# Altium project CoreV0.2.PrjPCB
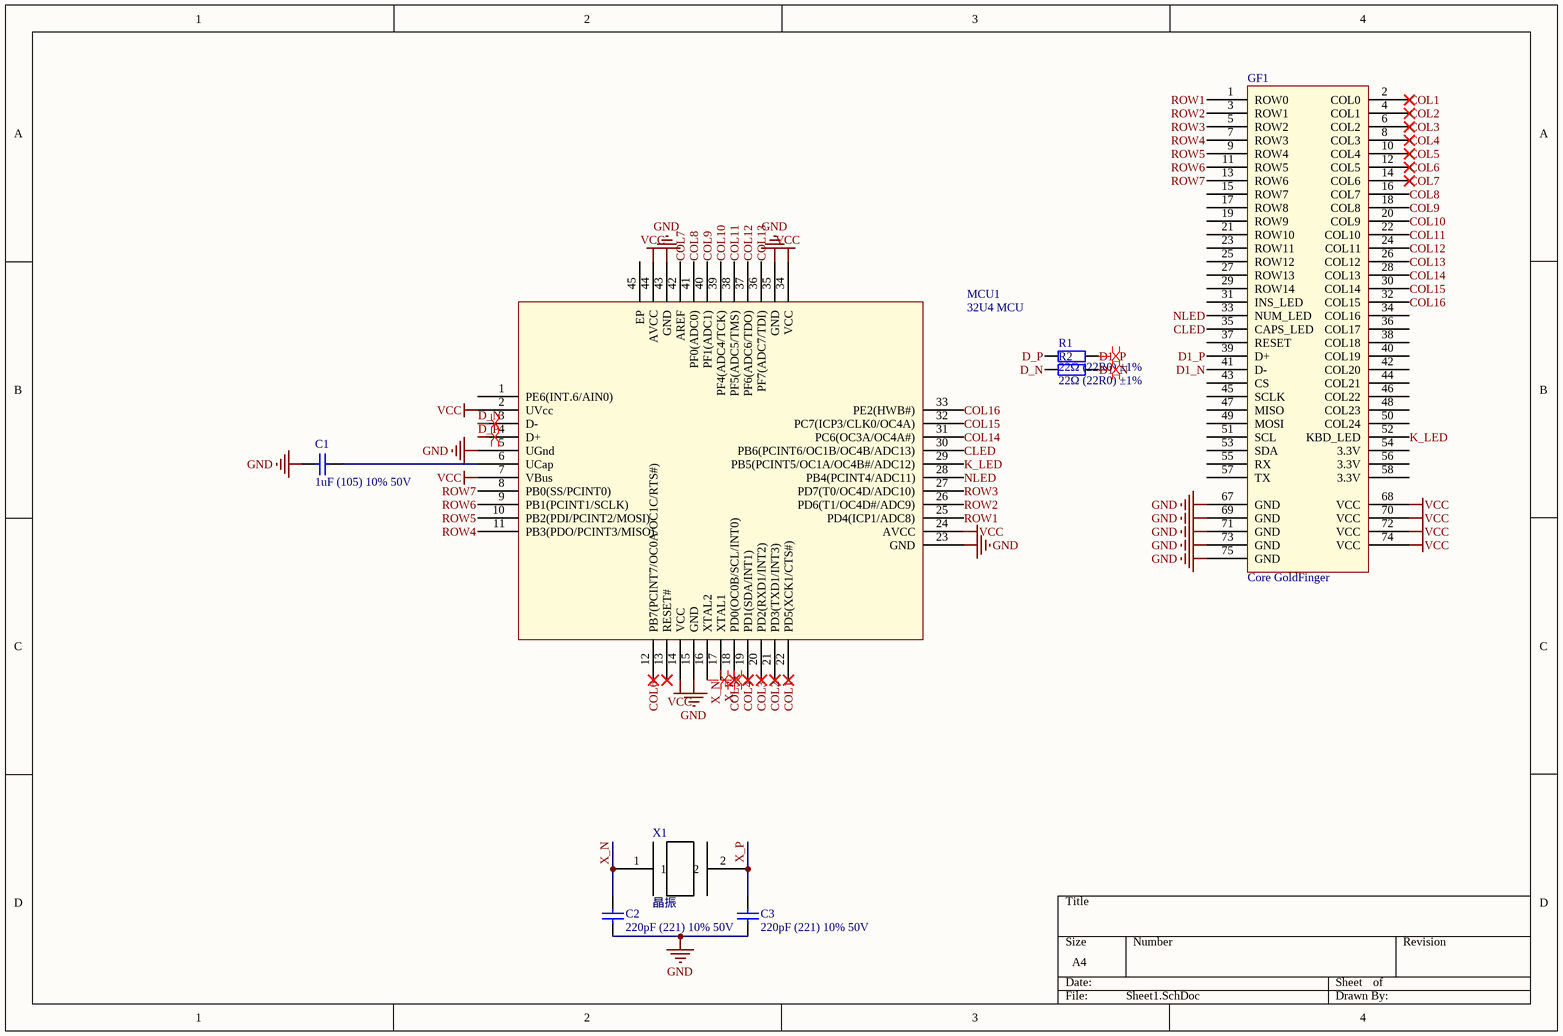
[diagram p0: Sheet1.SchDoc]
1 sheet, 8 parts. Net scope: global (net labels, ports and power ports of the same name join across sheets).
Board file: PCB1.PcbDoc

## Sheet Sheet1.SchDoc
size A4

### Parts
C1  1uF (105) 10% 50V  [1206_C]
C2  220pF (221) 10% 50V  [1206_C]
C3  220pF (221) 10% 50V  [1206_C]
GF1  Core GoldFinger  [Core GoldFinger]
MCU1  32U4 MCU  [32U4]
R1  22Ω (22R0) ±1%  [1206_R]
R2  22Ω (22R0) ±1%  [1206_R]
X1  晶振  [OSC-SMD_2P-L5.0-W3.2]

### Nets
GND: C1.1 C2.1 C3.1 GF1.67(GND) GF1.69(GND) GF1.71(GND) GF1.73(GND) GF1.75(GND) MCU1.5(UGnd) MCU1.15(GND) MCU1.23(GND) MCU1.35(GND) MCU1.43(GND)
VCC: GF1.68(VCC) GF1.70(VCC) GF1.72(VCC) GF1.74(VCC) MCU1.2(UVcc) MCU1.7(VBus) MCU1.14(VCC) MCU1.24(AVCC) MCU1.34(VCC) MCU1.44(AVCC)
CLED: GF1.35(CAPS_LED) MCU1.30(PB6(PCINT6/OC1B/OC4B/ADC13))
COL1: GF1.2(COL0) MCU1.22(PD5(XCK1/CTS#))
COL2: GF1.4(COL1) MCU1.21(PD3(TXD1/INT3))
COL3: GF1.6(COL2) MCU1.20(PD2(RXD1/INT2))
COL4: GF1.8(COL3) MCU1.19(PD1(SDA/INT1))
COL5: GF1.10(COL4) MCU1.18(PD0(OC0B/SCL/INT0))
COL6: GF1.12(COL5) MCU1.12(PB7(PCINT7/OC0A/OC1C/RTS#))
COL7: GF1.14(COL6) MCU1.42(AREF)
COL8: GF1.16(COL7) MCU1.41(PF0(ADC0))
COL9: GF1.18(COL8) MCU1.40(PF1(ADC1))
COL10: GF1.20(COL9) MCU1.39(PF4(ADC4/TCK))
COL11: GF1.22(COL10) MCU1.38(PF5(ADC5/TMS))
COL12: GF1.24(COL11) MCU1.37(PF6(ADC6/TDO))
COL13: GF1.26(COL12) MCU1.36(PF7(ADC7/TDI))
COL14: GF1.28(COL13) MCU1.31(PC6(OC3A/OC4A#))
COL15: GF1.30(COL14) MCU1.32(PC7(ICP3/CLK0/OC4A))
COL16: GF1.32(COL15) MCU1.33(PE2(HWB#))
D1_N: GF1.41(D-) R2.2
D1_P: GF1.39(D+) R1.2
D_N: MCU1.3(D-) R2.1
D_P: MCU1.4(D+) R1.1
K_LED: GF1.52(KBD_LED) MCU1.29(PB5(PCINT5/OC1A/OC4B#/ADC12))
NLED: GF1.33(NUM_LED) MCU1.28(PB4(PCINT4/ADC11))
ROW1: GF1.1(ROW0) MCU1.25(PD4(ICP1/ADC8))
ROW2: GF1.3(ROW1) MCU1.26(PD6(T1/OC4D#/ADC9))
ROW3: GF1.5(ROW2) MCU1.27(PD7(T0/OC4D/ADC10))
ROW4: GF1.7(ROW3) MCU1.11(PB3(PDO/PCINT3/MISO))
ROW5: GF1.9(ROW4) MCU1.10(PB2(PDI/PCINT2/MOSI))
ROW6: GF1.11(ROW5) MCU1.9(PB1(PCINT1/SCLK))
ROW7: GF1.13(ROW6) MCU1.8(PB0(SS/PCINT0))
X_N: C2.2 MCU1.16(XTAL2) X1.1
X_P: C3.2 MCU1.17(XTAL1) X1.2
NetC1_2: C1.2 MCU1.6(UCap)

Not connected (* = marked no-connect by the designer): GF1 15(ROW7) 17(ROW8) 19(ROW9) 21(ROW10) 23(ROW11) 25(ROW12) 27(ROW13) 29(ROW14) 31(INS_LED) 34(COL16) 36(COL17) 37(RESET) 38(COL18) 40(COL19) 42(COL20) 43(CS) 44(COL21) 45(SCLK) 46(COL22) 47(MISO) 48(COL23) 49(MOSI) 50(COL24) 51(SCL) 53(SDA) 54(3.3V) 55(RX) 56(3.3V) 57(TX) 58(3.3V); MCU1 1(PE6(INT.6/AIN0)) 13(RESET#)* 45(EP)

### Layout directives
differential pair: D1_N, D1_P, D_N, D_P, X_N, X_P

### Library data of the parts
C1 = 1206 1uF (105) 10% 50V: 贴片电容; ComponentLink1Description: 供应商链接; ComponentLink1URL: http://www.szlcsc.com/product/details_2200.html; Package: 1206; Supplier: LC; SuppliersPartNumber: C1848
C2 C3 = 1206 220pF (221) 10% 50V: 贴片电容; ComponentLink1Description: 供应商链接; ComponentLink1URL: http://www.szlcsc.com/product/details_2206.html; Package: 1206; Supplier: LC; SuppliersPartNumber: C1854
R1 R2 = 1206 22Ω (22R0) 1%: 贴片电阻; ComponentLink1Description: 供应商链接; ComponentLink1URL: http://www.szlcsc.com/product/details_18646.html; Package: 1206; Supplier: LC; SuppliersPartNumber: C17958